# EAGLE design 20170628-03 (EAGLE 8.2.2)
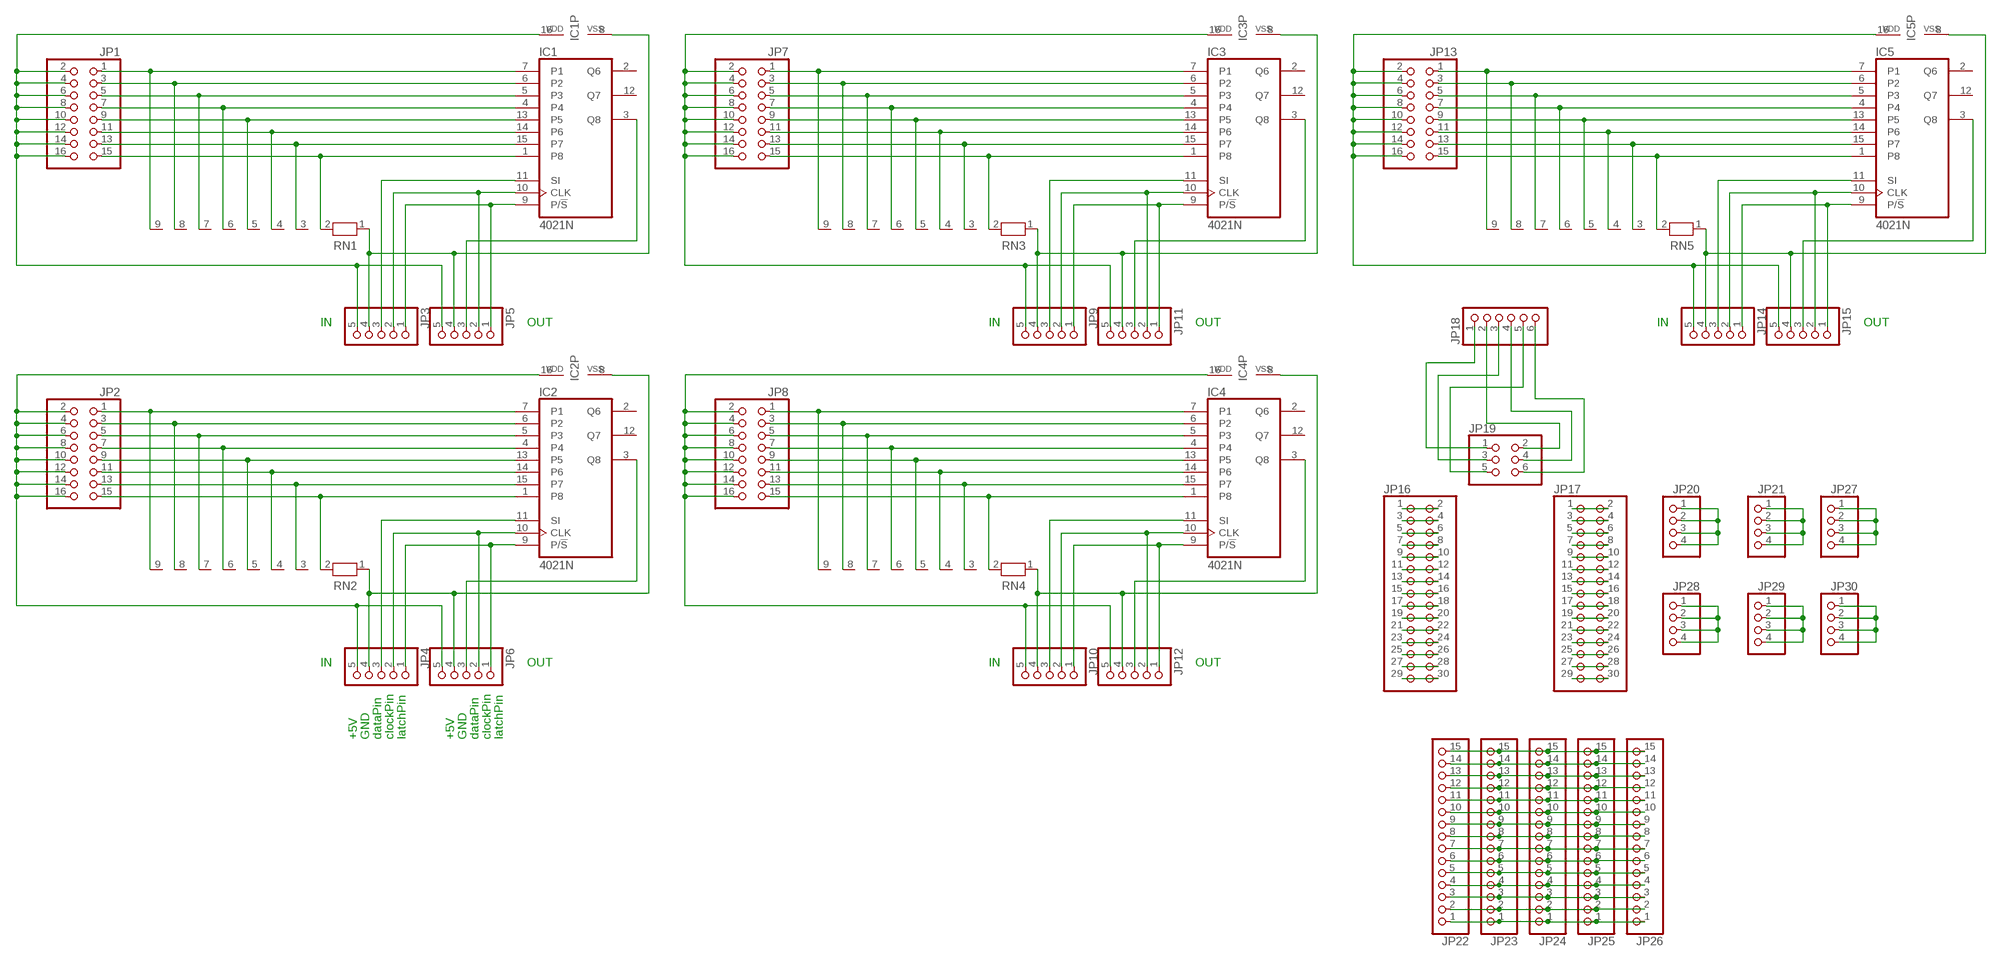
[diagram p0: schematic, sheet 1]

## Parts
IC1  4021N  [DIL16]
IC2  4021N  [DIL16]
IC3  4021N  [DIL16]
IC4  4021N  [DIL16]
IC5  4021N  [DIL16]
JP1  PINHD-2X8  [2X08]
JP2  PINHD-2X8  [2X08]
JP3  PINHD-1X5  [1X05]
JP4  PINHD-1X5  [1X05]
JP5  PINHD-1X5  [1X05]
JP6  PINHD-1X5  [1X05]
JP7  PINHD-2X8  [2X08]
JP8  PINHD-2X8  [2X08]
JP9  PINHD-1X5  [1X05]
JP10  PINHD-1X5  [1X05]
JP11  PINHD-1X5  [1X05]
JP12  PINHD-1X5  [1X05]
JP13  PINHD-2X8  [2X08]
JP14  PINHD-1X5  [1X05]
JP15  PINHD-1X5  [1X05]
JP16  PINHD-2X15  [2X15]
JP17  PINHD-2X15  [2X15]
JP18  PINHD-1X6  [1X06]
JP19  PINHD-2X3  [2X03]
JP20  PINHD-1X4  [1X04]
JP21  PINHD-1X4  [1X04]
JP22  PINHD-1X15  [1X15]
JP23  PINHD-1X15  [1X15]
JP24  PINHD-1X15  [1X15]
JP25  PINHD-1X15  [1X15]
JP26  PINHD-1X15  [1X15]
JP27  PINHD-1X4  [1X04]
JP28  PINHD-1X4  [1X04]
JP29  PINHD-1X4  [1X04]
JP30  PINHD-1X4  [1X04]
RN1  RN08  [RN-9]
RN2  RN08  [RN-9]
RN3  RN08  [RN-9]
RN4  RN08  [RN-9]
RN5  RN08  [RN-9]

## Nets
N$1: IC2.7(P1) JP2.1 RN2.9
N$2: IC2.6(P2) JP2.3 RN2.8
N$3: IC2.5(P3) JP2.5 RN2.7
N$4: IC2.4 JP2.7 RN2.6
N$5: IC2.13(P5) JP2.9 RN2.5
N$6: IC2.14(P6) JP2.11 RN2.4
N$7: IC2.15(P7) JP2.13 RN2.3
N$8: IC2.1(P8) JP2.15 RN2.2
N$9: IC2.9(P/!S) JP4.1 JP6.1
N$10: IC2.10(CLK) JP4.2 JP6.2
N$11: IC2.3(Q8) JP6.3
N$12: IC2.16(VDD) JP2.2 JP2.4 JP2.6 JP2.8 JP2.10 JP2.12 JP2.14 JP2.16 JP4.5 JP6.5
N$13: IC2.8(VSS) JP4.4 JP6.4 RN2.1
N$14: IC1.7(P1) JP1.1 RN1.9
N$15: IC1.6(P2) JP1.3 RN1.8
N$16: IC1.5(P3) JP1.5 RN1.7
N$17: IC1.4 JP1.7 RN1.6
N$18: IC1.13(P5) JP1.9 RN1.5
N$19: IC1.15(P7) JP1.13 RN1.3
N$20: IC1.11(SI) JP3.3
N$21: IC1.14(P6) JP1.11 RN1.4
N$22: IC1.1(P8) JP1.15 RN1.2
N$23: IC1.9(P/!S) JP3.1 JP5.1
N$24: IC1.10(CLK) JP3.2 JP5.2
N$25: IC1.3(Q8) JP5.3
N$26: IC1.16(VDD) JP1.2 JP1.4 JP1.6 JP1.8 JP1.10 JP1.12 JP1.14 JP1.16 JP3.5 JP5.5
N$27: IC1.8(VSS) JP3.4 JP5.4 RN1.1
N$28: IC3.7(P1) JP7.1 RN3.9
N$29: IC3.6(P2) JP7.3 RN3.8
N$30: IC3.5(P3) JP7.5 RN3.7
N$31: IC3.4 JP7.7 RN3.6
N$32: IC3.13(P5) JP7.9 RN3.5
N$33: IC3.15(P7) JP7.13 RN3.3
N$34: IC3.11(SI) JP9.3
N$35: IC3.14(P6) JP7.11 RN3.4
N$36: IC3.1(P8) JP7.15 RN3.2
N$37: IC3.9(P/!S) JP9.1 JP11.1
N$38: IC3.10(CLK) JP9.2 JP11.2
N$39: IC3.3(Q8) JP11.3
N$40: IC3.16(VDD) JP7.2 JP7.4 JP7.6 JP7.8 JP7.10 JP7.12 JP7.14 JP7.16 JP9.5 JP11.5
N$41: IC3.8(VSS) JP9.4 JP11.4 RN3.1
N$42: IC2.11(SI) JP4.3
N$43: IC4.7(P1) JP8.1 RN4.9
N$44: IC4.6(P2) JP8.3 RN4.8
N$45: IC4.5(P3) JP8.5 RN4.7
N$46: IC4.4 JP8.7 RN4.6
N$47: IC4.13(P5) JP8.9 RN4.5
N$48: IC4.15(P7) JP8.13 RN4.3
N$49: IC4.11(SI) JP10.3
N$50: IC4.14(P6) JP8.11 RN4.4
N$51: IC4.1(P8) JP8.15 RN4.2
N$52: IC4.9(P/!S) JP10.1 JP12.1
N$53: IC4.10(CLK) JP10.2 JP12.2
N$54: IC4.3(Q8) JP12.3
N$55: IC4.16(VDD) JP8.2 JP8.4 JP8.6 JP8.8 JP8.10 JP8.12 JP8.14 JP8.16 JP10.5 JP12.5
N$56: IC4.8(VSS) JP10.4 JP12.4 RN4.1
N$57: IC5.7(P1) JP13.1 RN5.9
N$58: IC5.6(P2) JP13.3 RN5.8
N$59: IC5.5(P3) JP13.5 RN5.7
N$60: IC5.4 JP13.7 RN5.6
N$61: IC5.13(P5) JP13.9 RN5.5
N$62: IC5.15(P7) JP13.13 RN5.3
N$63: IC5.11(SI) JP14.3
N$64: IC5.14(P6) JP13.11 RN5.4
N$65: IC5.1(P8) JP13.15 RN5.2
N$66: IC5.9(P/!S) JP14.1 JP15.1
N$67: IC5.10(CLK) JP14.2 JP15.2
N$68: IC5.3(Q8) JP15.3
N$69: IC5.16(VDD) JP13.2 JP13.4 JP13.6 JP13.8 JP13.10 JP13.12 JP13.14 JP13.16 JP14.5 JP15.5
N$70: IC5.8(VSS) JP14.4 JP15.4 RN5.1
N$71: JP16.1 JP16.2
N$72: JP16.3 JP16.4
N$73: JP16.5 JP16.6
N$74: JP16.7 JP16.8
N$75: JP16.9 JP16.10
N$76: JP16.11 JP16.12
N$77: JP16.13 JP16.14
N$78: JP16.15 JP16.16
N$79: JP16.17 JP16.18
N$80: JP16.19 JP16.20
N$81: JP16.21 JP16.22
N$82: JP16.23 JP16.24
N$83: JP16.25 JP16.26
N$84: JP16.27 JP16.28
N$85: JP16.29 JP16.30
N$86: JP17.1 JP17.2
N$87: JP17.3 JP17.4
N$88: JP17.5 JP17.6
N$89: JP17.7 JP17.8
N$90: JP17.9 JP17.10
N$91: JP17.11 JP17.12
N$92: JP17.13 JP17.14
N$93: JP17.15 JP17.16
N$94: JP17.17 JP17.18
N$95: JP17.19 JP17.20
N$96: JP17.21 JP17.22
N$97: JP17.23 JP17.24
N$98: JP17.25 JP17.26
N$99: JP17.27 JP17.28
N$100: JP17.29 JP17.30
N$101: JP18.1 JP19.1
N$102: JP18.3 JP19.3
N$103: JP18.5 JP19.5
N$104: JP18.2 JP19.2
N$105: JP18.4 JP19.4
N$106: JP18.6 JP19.6
N$107: JP20.1 JP20.2 JP20.3 JP20.4
N$108: JP21.1 JP21.2 JP21.3 JP21.4
N$109: JP27.1 JP27.2 JP27.3 JP27.4
N$110: JP22.1 JP23.1 JP24.1 JP25.1 JP26.1
N$111: JP22.2 JP23.2 JP24.2 JP25.2 JP26.2
N$112: JP22.3 JP23.3 JP24.3 JP25.3 JP26.3
N$113: JP22.4 JP23.4 JP24.4 JP25.4 JP26.4
N$114: JP22.5 JP23.5 JP24.5 JP25.5 JP26.5
N$115: JP22.6 JP23.6 JP24.6 JP25.6 JP26.6
N$116: JP22.7 JP23.7 JP24.7 JP25.7 JP26.7
N$117: JP22.8 JP23.8 JP24.8 JP25.8 JP26.8
N$118: JP22.9 JP23.9 JP24.9 JP25.9 JP26.9
N$119: JP22.10 JP23.10 JP24.10 JP25.10 JP26.10
N$120: JP22.11 JP23.11 JP24.11 JP25.11 JP26.11
N$121: JP22.12 JP23.12 JP24.12 JP25.12 JP26.12
N$122: JP22.13 JP23.13 JP24.13 JP25.13 JP26.13
N$123: JP22.14 JP23.14 JP24.14 JP25.14 JP26.14
N$124: JP22.15 JP23.15 JP24.15 JP25.15 JP26.15
N$125: JP28.1 JP28.2 JP28.3 JP28.4
N$126: JP29.1 JP29.2 JP29.3 JP29.4
N$127: JP30.1 JP30.2 JP30.3 JP30.4
Unconnected: IC1.2(Q6) IC1.12(Q7) IC2.2(Q6) IC2.12(Q7) IC3.2(Q6) IC3.12(Q7) IC4.2(Q6) IC4.12(Q7) IC5.2(Q6) IC5.12(Q7)

## Notes on the sheet
- IN | OUT | IN | OUT | IN | OUT
- IN | OUT | IN | OUT
- +5V | GND | dataPin | clockPin | latchPin | +5V | GND | dataPin | clockPin | latchPin

## Library data of the parts
IC1-IC5 = 40xx:4021: 8-bit static SHIFT REGISTER
JP1 JP2 JP7 JP8 JP13 = pinhead:PINHD-2X8: PIN HEADER
JP3-JP6 JP9-JP12 JP14 JP15 = pinhead:PINHD-1X5: PIN HEADER
JP16 JP17 = pinhead:PINHD-2X15: PIN HEADER
JP18 = pinhead:PINHD-1X6: PIN HEADER
JP19 = pinhead:PINHD-2X3: PIN HEADER
JP20 JP21 JP27-JP30 = pinhead:PINHD-1X4: PIN HEADER
JP22-JP26 = pinhead:PINHD-1X15: PIN HEADER
RN1-RN5 = resistor-net:RN08: RESISTOR NETWORK; OC_FARNELL: unknown; OC_NEWARK: unknown

## Board
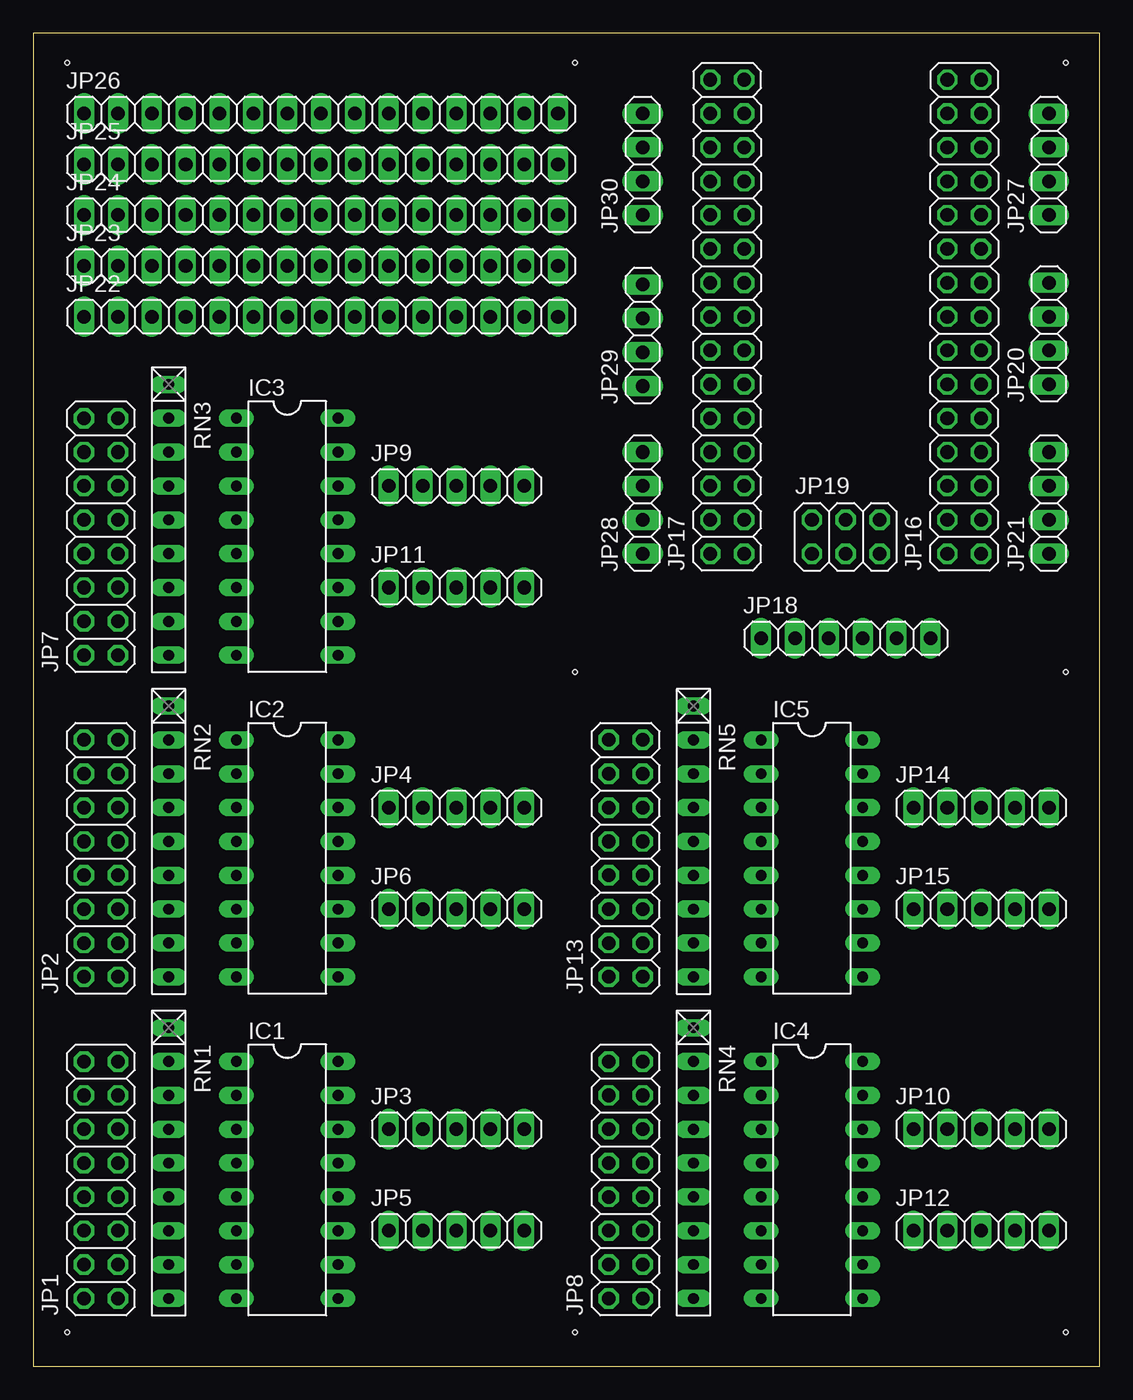
[diagram p1: board, top side]
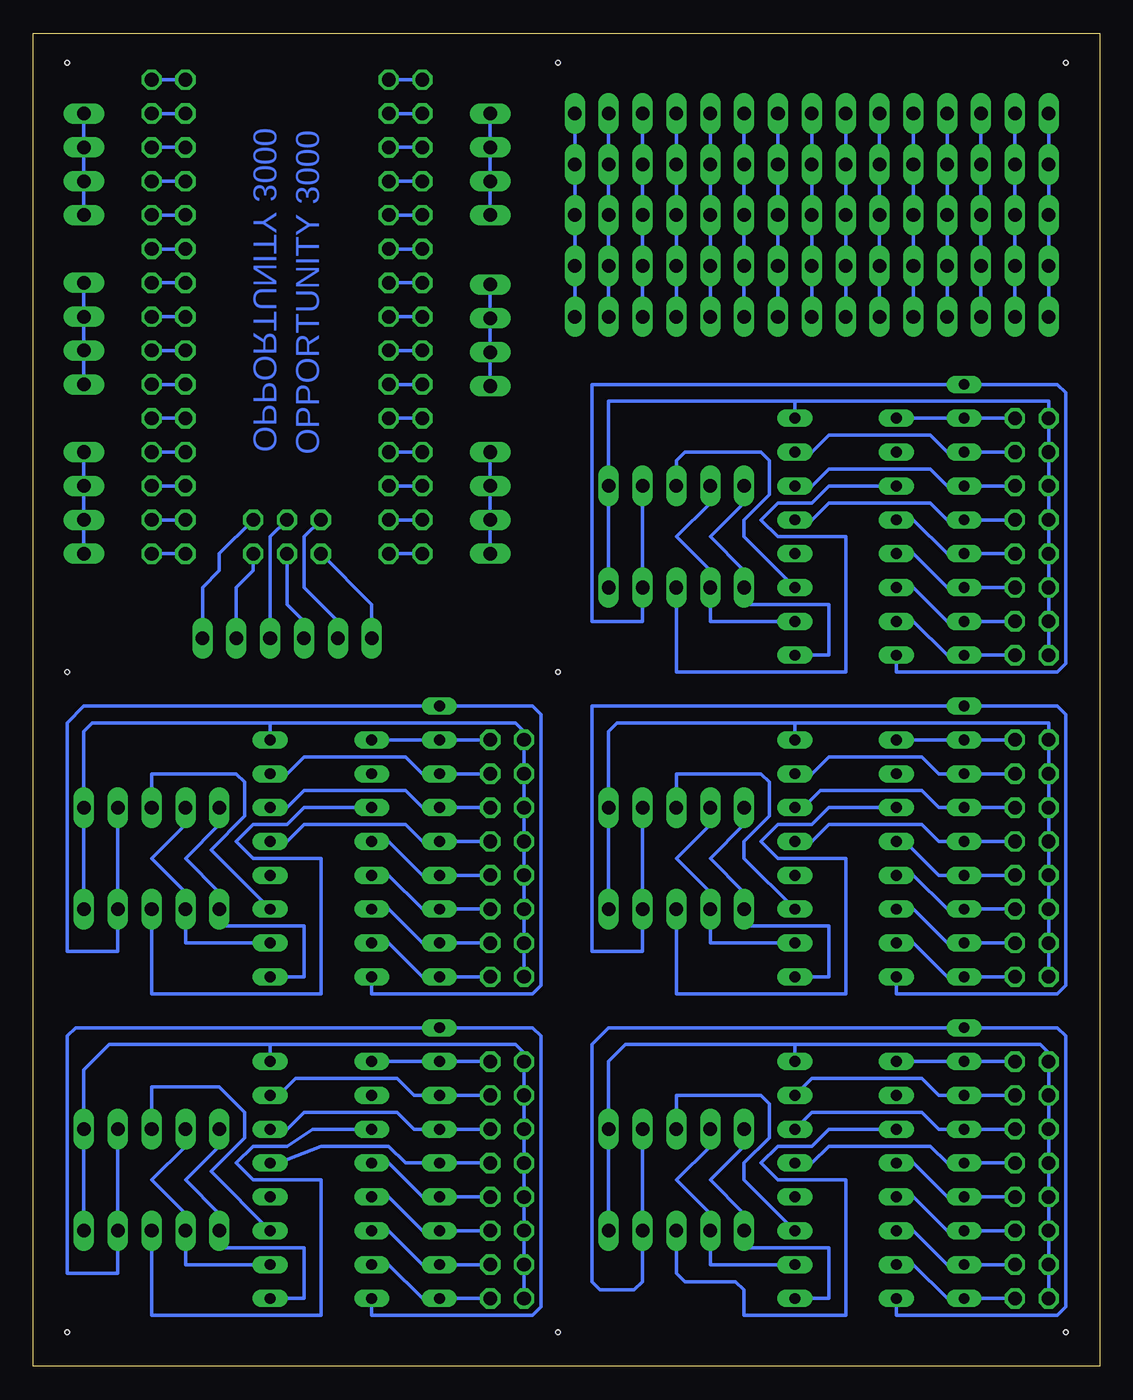
[diagram p2: board, bottom side, seen from below]

Size 80 x 100 mm. Coordinates in mm from the lower left corner, seen from the top.
Outline: 0,0 80,0 80,100 0,100 0,0
Copper layers (1*16): Top 0.035mm / dielectric 1.5mm / Bottom 0.035mm
Design rules "default": minimum track width 6mil, minimum drill 0.35mm, track to track 6mil, track to pad 6mil, pad to pad 6mil, via to via 6mil, smd to smd 6mil, copper to edge 40mil, drill to drill 6mil, minimum pad ring 10mil, minimum via ring 8mil, stop-mask expansion 4mil, vias tented up to drill 0mil, thermal gap 10mil
Holes 0.35 mm at 2.54,2.54 77.47,2.54 77.47,97.79 2.54,97.79 40.64,97.79 40.64,2.54 40.64,52.07 77.47,52.07

### Footprints (pad centres in the part's own frame; a part is rotated, then mirrored left to right if it is on the bottom)
DIL16 = drill 0.813 long: 1 -8.89,-3.81; 2 -6.35,-3.81; 3 -3.81,-3.81; 4 -1.27,-3.81; 5 1.27,-3.81; 6 3.81,-3.81; 7 6.35,-3.81; 8 8.89,-3.81; 9 8.89,3.81; 10 6.35,3.81; 11 3.81,3.81; 12 1.27,3.81; 13 -1.27,3.81; 14 -3.81,3.81; 15 -6.35,3.81; 16 -8.89,3.81
2X08 = drill 1.016 octagon: 1 -8.89,-1.27; 2 -8.89,1.27; 3 -6.35,-1.27; 4 -6.35,1.27; 5 -3.81,-1.27; 6 -3.81,1.27; 7 -1.27,-1.27; 8 -1.27,1.27; 9 1.27,-1.27; 10 1.27,1.27; 11 3.81,-1.27; 12 3.81,1.27; 13 6.35,-1.27; 14 6.35,1.27; 15 8.89,-1.27; 16 8.89,1.27
1X05 = drill 1.016 long: 1 -5.08,0; 2 -2.54,0; 3 0,0; 4 2.54,0; 5 5.08,0
2X15 = drill 1.016 octagon: 1 -17.78,-1.27; 2 -17.78,1.27; 3 -15.24,-1.27; 4 -15.24,1.27; 5 -12.7,-1.27; 6 -12.7,1.27; 7 -10.16,-1.27; 8 -10.16,1.27; 9 -7.62,-1.27; 10 -7.62,1.27; 11 -5.08,-1.27; 12 -5.08,1.27; 13 -2.54,-1.27; 14 -2.54,1.27; 15 0,-1.27; 16 0,1.27; 17 2.54,-1.27; 18 2.54,1.27; 19 5.08,-1.27; 20 5.08,1.27; 21 7.62,-1.27; 22 7.62,1.27; 23 10.16,-1.27; 24 10.16,1.27; 25 12.7,-1.27; 26 12.7,1.27; 27 15.24,-1.27; 28 15.24,1.27; 29 17.78,-1.27; 30 17.78,1.27
1X06 = drill 1.016 long: 1 -6.35,0; 2 -3.81,0; 3 -1.27,0; 4 1.27,0; 5 3.81,0; 6 6.35,0
2X03 = drill 1.016 octagon: 1 -2.54,-1.27; 2 -2.54,1.27; 3 0,-1.27; 4 0,1.27; 5 2.54,-1.27; 6 2.54,1.27
1X04 = drill 1.016 long: 1 -3.81,0; 2 -1.27,0; 3 1.27,0; 4 3.81,0
1X15 = drill 1.016 long: 1 -17.78,0; 2 -15.24,0; 3 -12.7,0; 4 -10.16,0; 5 -7.62,0; 6 -5.08,0; 7 -2.54,0; 8 0,0; 9 2.54,0; 10 5.08,0; 11 7.62,0; 12 10.16,0; 13 12.7,0; 14 15.24,0; 15 17.78,0
RN-9 = drill 0.813 long: 1 -10.16,0; 2 -7.62,0; 3 -5.08,0; 4 -2.54,0; 5 0,0; 6 2.54,0; 7 5.08,0; 8 7.62,0; 9 10.16,0

### Placement (x,y rotation side)
IC1  19.05,13.97 270 top
IC2  19.05,38.1 270 top
IC3  19.05,62.23 270 top
IC4  58.42,13.97 270 top
IC5  58.42,38.1 270 top
JP1  5.08,13.97 90 top
JP2  5.08,38.1 90 top
JP3  31.75,17.78 0 top
JP4  31.75,41.91 0 top
JP5  31.75,10.16 0 top
JP6  31.75,34.29 0 top
JP7  5.08,62.23 90 top
JP8  44.45,13.97 90 top
JP9  31.75,66.04 0 top
JP10  71.12,17.78 0 top
JP11  31.75,58.42 0 top
JP12  71.12,10.16 0 top
JP13  44.45,38.1 90 top
JP14  71.12,41.91 0 top
JP15  71.12,34.29 0 top
JP16  69.85,78.74 90 top
JP17  52.07,78.74 90 top
JP18  60.96,54.61 0 top
JP19  60.96,62.23 0 top
JP20  76.2,77.47 90 top
JP21  76.2,64.77 90 top
JP22  21.59,78.74 0 top
JP23  21.59,82.55 0 top
JP24  21.59,86.36 0 top
JP25  21.59,90.17 0 top
JP26  21.59,93.98 0 top
JP27  76.2,90.17 90 top
JP28  45.72,64.77 90 top
JP29  45.72,77.34 90 top
JP30  45.72,90.17 90 top
RN1  10.16,15.24 270 top
RN2  10.16,39.37 270 top
RN3  10.16,63.5 270 top
RN4  49.53,15.24 270 top
RN5  49.53,39.37 270 top

### Tracks (layer width: path | path; a pad name or v marks a point on that pad's centre or on a via)
N$1
  Bottom 0.254: JP2.1 RN2.9 11.43,29.21 13.97,31.75 IC2.7
N$2
  Bottom 0.254: JP2.3 RN2.8 11.43,31.75 13.97,34.29 IC2.6
N$3
  Bottom 0.254: JP2.5 RN2.7 11.43,34.29 13.97,36.83 IC2.5
N$4
  Bottom 0.254: JP2.7 RN2.6 12.06,36.83 14.61,39.37 IC2.4
N$5
  Bottom 0.254: JP2.9 RN2.5 12.06,39.37 13.34,40.64 20.32,40.64 21.59,39.37 IC2.13
N$6
  Bottom 0.254: JP2.11 RN2.4 12.06,41.91 13.34,43.18 20.95,43.18 22.23,41.91 IC2.14
N$7
  Bottom 0.254: JP2.13 RN2.3 12.06,44.45 13.34,45.72 20.32,45.72 21.59,44.45 IC2.15
N$8
  Bottom 0.254: JP2.15 RN2.2 IC2.1
N$9
  Bottom 0.254: JP4.1 26.67,40.64 29.21,38.1 26.67,35.56 JP6.1 26.67,33.02 20.32,33.02 20.32,29.21 IC2.9
N$10
  Bottom 0.254: JP4.2 29.21,40.64 31.75,38.1 29.21,35.56 JP6.2 29.21,31.75 IC2.10
N$11
  Bottom 0.254: IC2.3 20.32,41.91 21.59,40.64 24.13,40.64 25.4,39.37 24.13,38.1 19.05,38.1 19.05,27.94 31.75,27.94 JP6.3
N$12
  Bottom 0.254: JP6.5 36.83,41.78 JP4.5 36.83,47.62 36.2,48.26 22.86,48.26 | 22.86,48.26 3.81,48.26 JP2.16 JP2.14 JP2.12 JP2.10 JP2.8 JP2.6 JP2.4 JP2.2 | 22.86,48.26 IC2.16
N$13
  Bottom 0.254: IC2.8 15.24,27.94 3.17,27.94 2.54,28.57 2.54,48.9 3.17,49.53 RN2.1 38.1,49.53 38.1,31.11 34.29,31.11 JP6.4 JP4.4
N$14
  Bottom 0.254: JP1.1 RN1.9 11.43,5.08 13.97,7.62 IC1.7
N$15
  Bottom 0.254: JP1.3 RN1.8 11.43,7.62 13.97,10.16 IC1.6
N$16
  Bottom 0.254: JP1.5 RN1.7 11.43,10.16 13.97,12.7 IC1.5
N$17
  Bottom 0.254: JP1.7 RN1.6 11.43,12.7 13.97,15.24 IC1.4
N$18
  Bottom 0.254: JP1.9 RN1.5 11.43,15.24 12.7,16.51 20.32,16.51 21.59,15.24 IC1.13
N$19
  Bottom 0.254: JP1.13 RN1.3 12.06,20.32 13.34,21.59 21.59,21.59 IC1.15
N$20
  Bottom 0.254: IC1.11 26.67,13.97 26.67,15.24 24.77,17.14 24.77,19.68 25.4,20.32 31.75,20.32 JP3.3
N$21
  Bottom 0.254: JP1.11 RN1.4 12.06,17.78 13.34,19.05 21.59,19.05 IC1.14
N$22
  Bottom 0.254: JP1.15 RN1.2 IC1.1
N$23
  Bottom 0.254: JP3.1 26.67,16.51 29.21,13.97 26.67,11.43 JP5.1 | JP5.1 | IC1.9 20.32,5.08 20.32,8.89 26.67,8.89 JP5.1
N$24
  Bottom 0.254: JP3.2 29.21,16.51 31.75,13.97 29.21,11.43 29.21,10.23 | 29.21,10.23 JP5.2 | IC1.10 29.21,7.62 29.21,10.23
N$25
  Bottom 0.254: IC1.3 20.32,17.78 21.59,16.51 24.13,16.51 25.4,15.24 24.13,13.97 19.05,13.97 19.05,3.81 26.67,3.81 26.67,5.71 27.3,6.35 31.11,6.35 31.75,6.99 JP5.3
N$26
  Bottom 0.254: JP5.5 JP3.5 36.83,22.86 35.56,24.13 22.86,24.13 | 22.86,24.13 4.45,24.13 3.81,23.5 JP1.16 JP1.14 JP1.12 JP1.10 JP1.8 JP1.6 JP1.4 JP1.2 | 22.86,24.13 IC1.16
N$27
  Bottom 0.254: IC1.8 15.24,3.81 3.17,3.81 2.54,4.45 2.54,24.77 3.17,25.4 RN1.1 36.83,25.4 38.1,24.13 38.1,6.35 37.47,5.71 34.92,5.71 34.29,6.35 JP5.4 JP3.4
N$28
  Bottom 0.254: JP7.1 RN3.9 11.43,53.34 13.97,55.88 IC3.7
N$29
  Bottom 0.254: JP7.3 RN3.8 11.43,55.88 13.97,58.42 IC3.6
N$30
  Bottom 0.254: JP7.5 RN3.7 11.43,58.42 13.97,60.96 IC3.5
N$31
  Bottom 0.254: JP7.7 RN3.6 11.43,60.96 13.97,63.5 IC3.4
N$32
  Bottom 0.254: JP7.9 RN3.5 11.43,63.5 12.7,64.77 20.32,64.77 21.59,63.5 IC3.13
N$33
  Bottom 0.254: JP7.13 RN3.3 11.43,68.58 12.7,69.85 20.32,69.85 21.59,68.58 IC3.15
N$34
  Bottom 0.254: IC3.11 26.67,62.23 26.67,63.5 24.77,65.41 24.77,67.94 25.4,68.58 31.11,68.58 31.75,67.94 JP9.3
N$35
  Bottom 0.254: JP7.11 RN3.4 11.43,66.04 12.7,67.31 20.32,67.31 21.59,66.04 IC3.14
N$36
  Bottom 0.254: JP7.15 RN3.2 IC3.1
N$37
  Bottom 0.254: 26.67,58.5 JP11.1 26.67,58.29 | IC3.9 20.32,53.34 20.32,57.15 26.67,57.15 26.67,58.29 | JP9.1 26.67,64.77 29.21,62.23 26.67,59.69 26.67,58.29
N$38
  Bottom 0.254: IC3.10 29.21,55.88 29.21,58.29 | 29.21,58.29 JP11.2 | JP9.2 29.21,64.77 31.75,62.23 29.21,59.69 29.21,58.29
N$39
  Bottom 0.254: IC3.3 20.32,66.04 21.59,64.77 24.13,64.77 25.4,63.5 24.13,62.23 19.05,62.23 19.05,52.07 31.75,52.07 JP11.3
N$40
  Bottom 0.254: 22.86,72.39 3.81,72.39 3.81,71.25 | 22.86,72.39 IC3.16 | 22.86,72.39 36.83,72.39 JP9.5 JP11.5 | 3.81,71.25 JP7.16 | JP7.2 JP7.4 JP7.6 JP7.8 JP7.10 JP7.12 JP7.14 3.81,71.25
N$41
  Bottom 0.254: JP9.4 JP11.4 34.29,55.88 38.1,55.88 38.1,73.66 RN3.1 | RN3.1 | IC3.8 15.24,52.07 3.17,52.07 2.54,52.7 2.54,73.03 3.17,73.66 RN3.1
N$42
  Bottom 0.254: IC2.11 26.67,38.1 26.67,39.37 24.77,41.27 24.77,43.81 25.4,44.45 31.75,44.45 JP4.3
N$43
  Bottom 0.254: JP8.1 RN4.9 50.8,5.08 53.34,7.62 IC4.7
N$44
  Bottom 0.254: JP8.3 RN4.8 50.8,7.62 53.34,10.16 IC4.6
N$45
  Bottom 0.254: JP8.5 RN4.7 50.8,10.16 53.34,12.7 IC4.5
N$46
  Bottom 0.254: JP8.7 RN4.6 50.8,12.7 53.34,15.24 IC4.4
N$47
  Bottom 0.254: JP8.9 RN4.5 52.07,15.24 53.34,16.51 58.42,16.51 61.59,15.24 IC4.13
N$48
  Bottom 0.254: JP8.13 RN4.3 51.44,20.32 52.7,21.59 60.33,21.59 61.59,20.32 IC4.15
N$49
  Bottom 0.254: IC4.11 66.67,14.61 64.14,17.14 64.14,19.05 66.04,20.95 71.12,20.95 JP10.3
N$50
  Bottom 0.254: JP8.11 RN4.4 51.44,17.78 52.7,19.05 59.69,19.05 60.96,17.78 IC4.14
N$51
  Bottom 0.254: JP8.15 RN4.2 IC4.1
N$52
  Bottom 0.254: JP10.1 66.04,16.51 68.58,13.97 66.04,11.43 JP12.1 66.04,8.89 59.69,8.89 59.69,5.08 IC4.9
N$53
  Bottom 0.254: JP10.2 68.58,16.51 71.12,13.97 68.58,11.43 JP12.2 68.58,7.62 IC4.10
N$54
  Bottom 0.254: JP12.3 71.12,3.81 58.42,3.81 58.42,13.97 63.5,13.97 64.77,15.24 63.5,16.51 60.96,16.51 59.05,17.78 IC4.3
N$55
  Bottom 0.254: JP12.5 JP10.5 76.2,22.23 74.3,24.13 62.23,24.13 | 62.23,24.13 43.81,24.13 43.18,23.5 JP8.16 JP8.14 JP8.12 JP8.10 JP8.8 JP8.6 JP8.4 JP8.2 | 62.23,24.13 IC4.16
N$56
  Bottom 0.254: IC4.8 54.61,3.81 42.55,3.81 41.91,4.45 41.91,24.77 42.55,25.4 RN4.1 76.83,25.4 77.47,24.77 77.47,6.99 73.66,6.99 73.66,10.29 | 73.66,10.29 JP10.4 | 73.66,10.29 JP12.4
N$57
  Bottom 0.254: JP13.1 RN5.9 50.8,29.21 53.34,31.75 IC5.7
N$58
  Bottom 0.254: JP13.3 RN5.8 50.8,31.75 53.34,34.29 IC5.6
N$59
  Bottom 0.254: JP13.5 RN5.7 50.8,34.29 53.34,36.83 IC5.5
N$60
  Bottom 0.254: JP13.7 RN5.6 50.8,36.83 53.34,39.37 IC5.4
N$61
  Bottom 0.254: JP13.9 RN5.5 50.8,39.37 52.07,40.64 59.69,40.64 60.96,39.37 IC5.13
N$62
  Bottom 0.254: JP13.13 RN5.3 50.8,44.45 52.07,45.72 59.69,45.72 60.96,44.45 IC5.15
N$63
  Bottom 0.254: IC5.11 66.67,38.73 64.14,41.27 64.14,43.81 64.77,44.45 71.12,44.45 JP14.3
N$64
  Bottom 0.254: JP13.11 RN5.4 50.8,41.91 52.07,43.18 59.69,43.18 60.96,41.91 IC5.14
N$65
  Bottom 0.254: JP13.15 RN5.2 IC5.1
N$66
  Bottom 0.254: JP14.1 66.04,40.64 68.58,38.1 66.04,35.56 JP15.1 66.04,33.02 59.69,33.02 59.69,29.21 IC5.9
N$67
  Bottom 0.254: JP14.2 68.58,40.64 71.12,38.1 68.58,35.56 JP15.2 68.58,31.75 IC5.10
N$68
  Bottom 0.254: JP15.3 71.12,27.94 58.42,27.94 58.42,38.1 63.5,38.1 64.77,39.37 63.5,40.64 60.96,40.64 59.69,41.91 IC5.3
N$69
  Bottom 0.254: JP15.5 76.2,41.85 JP14.5 76.2,47.62 75.56,48.26 62.23,48.26 | 62.23,48.26 43.81,48.26 43.18,47.62 JP13.16 JP13.14 JP13.12 JP13.10 JP13.8 JP13.6 JP13.4 JP13.2 | 62.23,48.26 IC5.16
N$70
  Bottom 0.254: IC5.8 54.61,27.94 42.55,27.94 41.91,28.57 41.91,48.9 42.55,49.53 RN5.1 76.2,49.53 77.47,48.26 77.47,31.11 73.66,31.11 73.66,34.3 | 73.66,34.3 JP14.4 | 73.66,34.3 JP15.4
N$71
  Bottom 0.254: JP16.2 JP16.1
N$72
  Bottom 0.254: JP16.4 JP16.3
N$73
  Bottom 0.254: JP16.5 JP16.6
N$74
  Bottom 0.254: JP16.8 JP16.7
N$75
  Bottom 0.254: JP16.9 JP16.10
N$76
  Bottom 0.254: JP16.12 JP16.11
N$77
  Bottom 0.254: JP16.13 JP16.14
N$78
  Bottom 0.254: JP16.16 JP16.15
N$79
  Bottom 0.254: JP16.17 JP16.18
N$80
  Bottom 0.254: JP16.20 JP16.19
N$81
  Bottom 0.254: JP16.21 JP16.22
N$82
  Bottom 0.254: JP16.24 JP16.23
N$83
  Bottom 0.254: JP16.25 JP16.26
N$84
  Bottom 0.254: JP16.28 JP16.27
N$85
  Bottom 0.254: JP16.29 JP16.30
N$86
  Bottom 0.254: JP17.2 JP17.1
N$87
  Bottom 0.254: JP17.4 JP17.3
N$88
  Bottom 0.254: JP17.6 JP17.5
N$89
  Bottom 0.254: JP17.8 JP17.7
N$90
  Bottom 0.254: JP17.10 JP17.9
N$91
  Bottom 0.254: JP17.12 JP17.11
N$92
  Bottom 0.254: JP17.14 JP17.13
N$93
  Bottom 0.254: JP17.16 JP17.15
N$94
  Bottom 0.254: JP17.18 JP17.17
N$95
  Bottom 0.254: JP17.20 JP17.19
N$96
  Bottom 0.254: JP17.22 JP17.21
N$97
  Bottom 0.254: JP17.24 JP17.23
N$98
  Bottom 0.254: JP17.26 JP17.25
N$99
  Bottom 0.254: JP17.28 JP17.27
N$100
  Bottom 0.254: JP17.30 JP17.29
N$101
  Bottom 0.254: JP19.1 54.61,57.15 JP18.1
N$102
  Bottom 0.254: JP19.3 60.96,57.15 59.69,55.88 JP18.3
N$103
  Bottom 0.254: JP19.5 63.5,59.69 64.77,58.42 JP18.5
N$104
  Bottom 0.254: JP19.2 59.69,62.23 59.69,58.42 57.15,55.88 JP18.2
N$105
  Bottom 0.254: JP19.4 62.23,62.23 JP18.4
N$106
  Bottom 0.254: JP19.6 66.04,60.96 66.04,59.69 67.31,58.42 JP18.6
N$107
  Bottom 0.254: JP20.1 JP20.2 JP20.3 JP20.4
N$108
  Bottom 0.254: JP21.1 JP21.2 JP21.3 JP21.4
N$109
  Bottom 0.254: JP27.4 JP27.3 JP27.2 JP27.1
N$110
  Bottom 0.254: JP22.1 JP23.1 JP24.1 JP25.1 JP26.1
N$111
  Bottom 0.254: JP26.2 JP25.2 JP24.2 JP23.2 JP22.2
N$112
  Bottom 0.254: JP22.3 JP23.3 JP24.3 JP25.3 JP26.3
N$113
  Bottom 0.254: JP26.4 JP25.4 JP24.4 JP23.4 JP22.4
N$114
  Bottom 0.254: JP22.5 JP23.5 JP24.5 JP25.5 JP26.5
N$115
  Bottom 0.254: JP26.6 JP25.6 JP24.6 JP23.6 JP22.6
N$116
  Bottom 0.254: JP22.7 JP23.7 JP24.7 JP25.7 JP26.7
N$117
  Bottom 0.254: JP26.8 JP25.8 JP24.8 JP23.8 JP22.8
N$118
  Bottom 0.254: JP22.9 JP23.9 JP24.9 JP25.9 JP26.9
N$119
  Bottom 0.254: JP26.10 JP25.10 JP24.10 26.67,82.42 | 26.67,82.42 JP22.10 | 26.67,82.42 JP23.10
N$120
  Bottom 0.254: JP22.11 JP23.11 JP24.11 JP25.11 JP26.11
N$121
  Bottom 0.254: JP26.12 JP25.12 JP24.12 JP23.12 JP22.12
N$122
  Bottom 0.254: JP22.13 JP23.13 JP24.13 JP25.13 JP26.13
N$123
  Bottom 0.254: JP26.14 JP25.14 JP24.14 JP23.14 JP22.14
N$124
  Bottom 0.254: JP22.15 JP23.15 JP24.15 JP25.15 JP26.15
N$125
  Bottom 0.254: JP28.4 JP28.3 JP28.2 JP28.1
N$126
  Bottom 0.254: JP29.4 JP29.3 JP29.2 JP29.1
N$127
  Bottom 0.254: JP30.4 JP30.3 JP30.2 JP30.1

### Text on the board
Bottom: OPPORTUNITY 3000 | OPPORTUNITY 3000